# Altium schematic sheet modFOC-Powerstage.SchDoc: modFOC-Powerstage
size A4; Organization: HTL St. Pölten; Address1: Mathias Giller; DocumentNumber: 3; Revision: 1.0; SheetNumber: 3; SheetTotal: 3
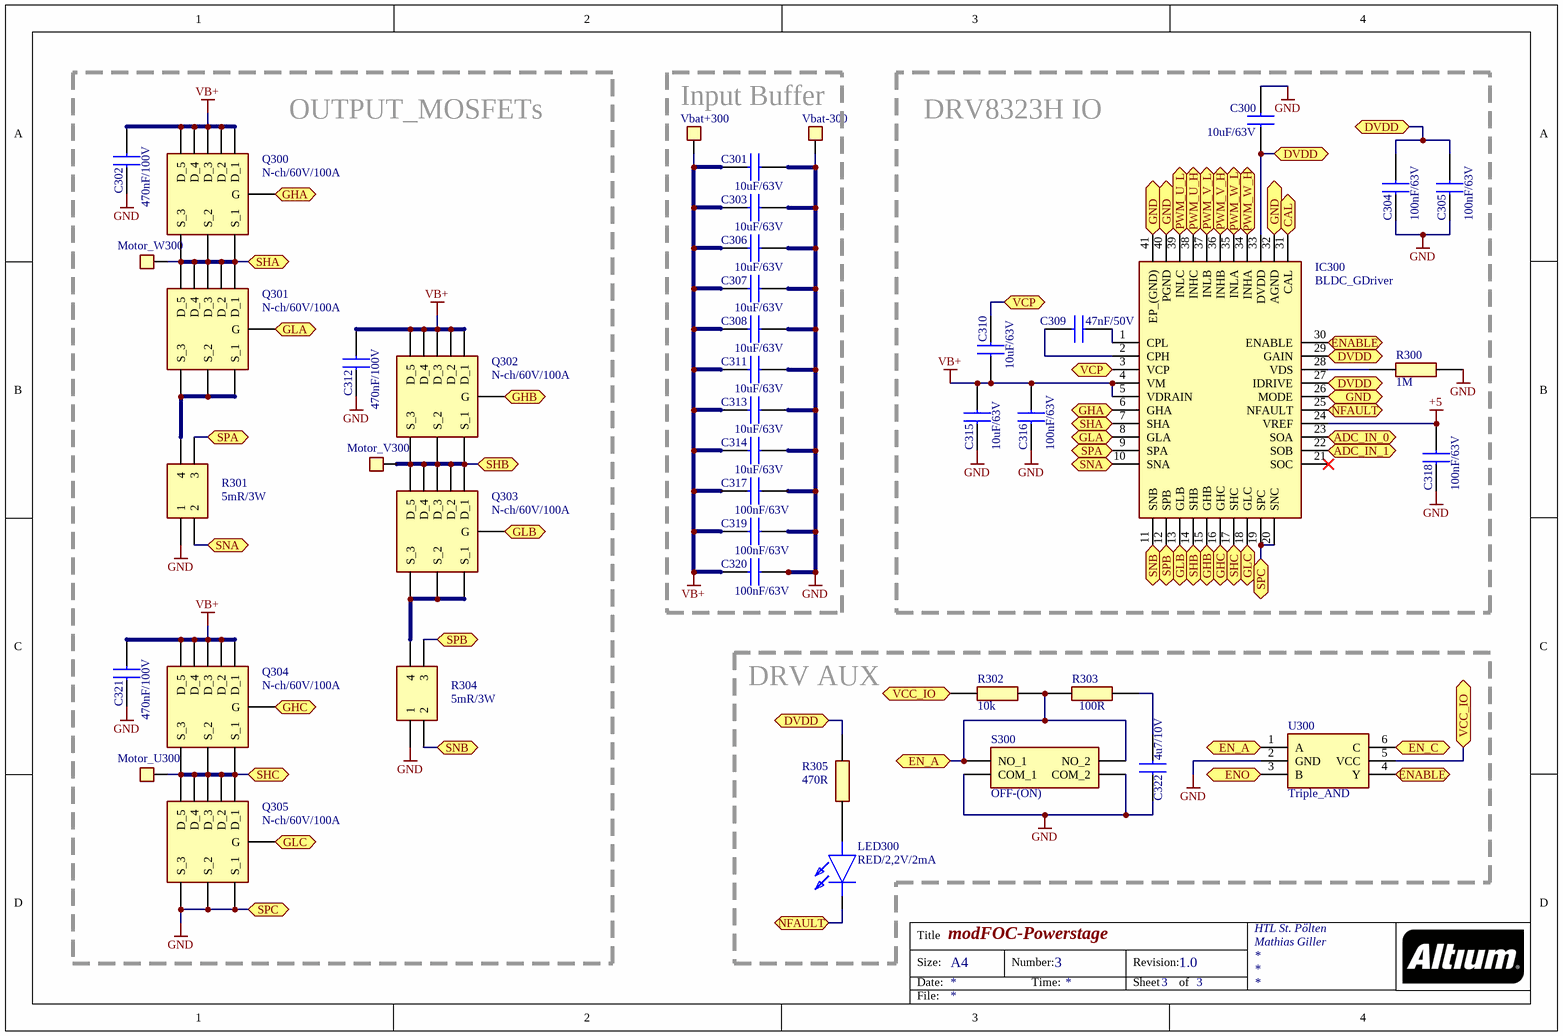
[diagram p0: modFOC-Powerstage.SchDoc]

## Parts
C300  10uF/63V  [CAPC3225X280N]
C301  10uF/63V  [CAPC3225X280N]
C302  470nF/100V  [CAPC2012X140N]
C303  10uF/63V  [CAPC3225X280N]
C304  100nF/63V  [CAPC1608X97N]
C305  100nF/63V  [CAPC1608X97N]
C306  10uF/63V  [CAPC3225X280N]
C307  10uF/63V  [CAPC3225X280N]
C308  10uF/63V  [CAPC3225X280N]
C309  47nF/50V  [CAPC1608X90N]
C310  10uF/63V  [CAPC3225X280N]
C311  10uF/63V  [CAPC3225X280N]
C312  470nF/100V  [CAPC2012X140N]
C313  10uF/63V  [CAPC3225X280N]
C314  10uF/63V  [CAPC3225X280N]
C315  10uF/63V  [CAPC3225X280N]
C316  100nF/63V  [CAPC1608X97N]
C317  100nF/63V  [CAPC1608X97N]
C318  100nF/63V  [CAPC1608X97N]
C319  100nF/63V  [CAPC1608X97N]
C320  100nF/63V  [CAPC1608X97N]
C321  470nF/100V  [CAPC2012X140N]
C322  4u7/10V  [CAPC1608X90N]
IC300  BLDC_GDriver  [QFN50P600X600X80-41N-D]
LED300  RED/2,2V/2mA  [LSL29KG1J21Z]
Motor_U300  PowerPad  [POWER_PAD]  (value not drawn)
Motor_V300  PowerPad  [POWER_PAD]  (value not drawn)
Motor_W300  PowerPad  [POWER_PAD]  (value not drawn)
Q300  N-ch/60V/100A  [TPHR9003NLL1Q]
Q301  N-ch/60V/100A  [TPHR9003NLL1Q]
Q302  N-ch/60V/100A  [TPHR9003NLL1Q]
Q303  N-ch/60V/100A  [TPHR9003NLL1Q]
Q304  N-ch/60V/100A  [TPHR9003NLL1Q]
Q305  N-ch/60V/100A  [TPHR9003NLL1Q]
R300  1M  [RESC1608X55N]
R301  5mR/3W  [WSK12161L000FEA]
R302  10k  [RESC1608X55N]
R303  100R  [RESC1608X55N]
R304  5mR/3W  [WSK12161L000FEA]
R305  470R  [RESC1608X55N]
S300  OFF-(ON)  [PTS647SK38SMTR2LFS]
U300  Triple_AND  [SOT95P285X140-6N]
Vbat+300  PW_PAD_SMOL  [PW_PAD_SMOL]  (value not drawn)
Vbat-300  PW_PAD_SMOL  [PW_PAD_SMOL]  (value not drawn)

## Blocks framed on the sheet
OUTPUT_MOSFETs: C302 C312 C321 Motor_U300 Motor_V300 Motor_W300 Q300-Q305 R301 R304
Input Buffer: C301 C303 C306-C308 C311 C313 C314 C317 C319 C320 Vbat+300 Vbat-300
DRV8323H IO: C300 C304 C305 C309 C310 C315 C316 C318 IC300 R300
DRV AUX: C322 LED300 R302 R303 R305 S300 U300

## Ports
ADC_IN_0 (bidir), ADC_IN_1 (bidir), CAL (bidir), DVDD (bidir), EN_A (bidir), EN_C (bidir), ENABLE (bidir), ENO (bidir), GHA (bidir), GHB (bidir), GHC (bidir), GLA (bidir), GLB (bidir), GLC (bidir), GND (bidir), NFAULT (bidir), PWM_U_H (bidir), PWM_U_L (bidir), PWM_V_H (bidir), PWM_V_L (bidir), PWM_W_H (bidir), PWM_W_L (bidir), SHA (bidir), SHB (bidir), SHC (bidir), SNA (bidir), SNB (bidir), SPA (bidir), SPB (bidir), SPC (bidir), VCC_IO (bidir), VCP (bidir)

## Nets
+5: C318.2 IC300.24(VREF)
GND: C300.1 C301.1 C302.1 C303.1 C304.1 C305.1 C306.1 C307.1 C308.1 C311.1 C312.1 C313.1 C314.1 C315.1 C316.1 C317.2 C318.1 C319.2 C320.2 C321.1 C322.1 IC300.19(SPC) IC300.20(SNC) Q305.1(S_1) Q305.2(S_2) Q305.3(S_3) R300.2 R301.1 R304.1 S300.3(COM_1) S300.4(COM_2) U300.2(GND) Vbat-300.1 ; port SPC
VB+: C301.2 C302.2 C303.2 C306.2 C307.2 C308.2 C310.1 C311.2 C312.2 C313.2 C314.2 C315.2 C316.2 C317.1 C319.1 C320.1 C321.2 IC300.4(VM) IC300.5(VDRAIN) Q300.5(D_1) Q300.6(D_2) Q300.7(D_3) Q300.8(D_4) Q300.9(D_5) Q302.5(D_1) Q302.6(D_2) Q302.7(D_3) Q302.8(D_4) Q302.9(D_5) Q304.5(D_1) Q304.6(D_2) Q304.7(D_3) Q304.8(D_4) Q304.9(D_5) Vbat+300.1
ADC_IN_0: IC300.23(SOA) ; port ADC_IN_0
ADC_IN_1: IC300.22(SOB) ; port ADC_IN_1
CAL: IC300.31(CAL) ; port CAL
DVDD: C300.2 C304.2 C305.2 IC300.27(IDRIVE) IC300.29(GAIN) IC300.33(DVDD) R305.2 ; port DVDD
EN_A: R302.2 R303.1 S300.1(NO_1) S300.2(NO_2) U300.1(A) ; port EN_A
EN_C: U300.6(C) ; port EN_C
ENABLE: IC300.30(ENABLE) U300.4(Y) ; port ENABLE
ENO: U300.3(B) ; port ENO
GHA: IC300.6(GHA) Q300.4(G) ; port GHA
GHB: IC300.15(GHB) Q302.4(G) ; port GHB
GHC: IC300.16(GHC) Q304.4(G) ; port GHC
GLA: IC300.8(GLA) Q301.4(G) ; port GLA
GLB: IC300.13(GLB) Q303.4(G) ; port GLB
GLC: IC300.18(GLC) Q305.4(G) ; port GLC
GND: IC300.26(MODE) IC300.32(AGND) IC300.40(PGND) IC300.41(EP_(GND)) ; port GND  [a separate net that carries the same name]
NFAULT: IC300.25(NFAULT) LED300.1(K) ; port NFAULT
PWM_U_H: IC300.38(INHC) ; port PWM_U_H
PWM_U_L: IC300.39(INLC) ; port PWM_U_L
PWM_V_H: IC300.36(INHB) ; port PWM_V_H
PWM_V_L: IC300.37(INLB) ; port PWM_V_L
PWM_W_H: IC300.34(INHA) ; port PWM_W_H
PWM_W_L: IC300.35(INLA) ; port PWM_W_L
SHA: IC300.7(SHA) Motor_W300.1 Q300.1(S_1) Q300.2(S_2) Q300.3(S_3) Q301.5(D_1) Q301.6(D_2) Q301.7(D_3) Q301.8(D_4) Q301.9(D_5) ; port SHA
SHB: IC300.14(SHB) Motor_V300.1 Q302.1(S_1) Q302.2(S_2) Q302.3(S_3) Q303.5(D_1) Q303.6(D_2) Q303.7(D_3) Q303.8(D_4) Q303.9(D_5) ; port SHB
SHC: IC300.17(SHC) Motor_U300.1 Q304.1(S_1) Q304.2(S_2) Q304.3(S_3) Q305.5(D_1) Q305.6(D_2) Q305.7(D_3) Q305.8(D_4) Q305.9(D_5) ; port SHC
SNA: IC300.10(SNA) R301.2 ; port SNA
SNB: IC300.11(SNB) R304.2 ; port SNB
SPA: IC300.9(SPA) R301.3 ; port SPA
SPB: IC300.12(SPB) R304.3 ; port SPB
VCC_IO: R302.1 U300.5(VCC) ; port VCC_IO
VCP: C310.2 IC300.3(VCP) ; port VCP
NetC309_1: C309.1 IC300.2(CPH)
NetC309_2: C309.2 IC300.1(CPL)
NetC322_2: C322.2 R303.2
NetIC300_28: IC300.28(VDS) R300.1
NetLED300_2: LED300.2(A) R305.1
NetQ301_1: Q301.1(S_1) Q301.2(S_2) Q301.3(S_3) R301.4
NetQ303_1: Q303.1(S_1) Q303.2(S_2) Q303.3(S_3) R304.4

Not connected (* = marked no-connect by the designer): IC300 21(SOC)*

## Notes on the sheet
- Title
- Size:
- Date:
- A4
- Number:
- Time:
- Revision:
- Sheet
- of
- File:

## Library data of the parts
C300 C301 C303 C306-C308 C310 C311 C313-C315 = CL32B106KMVNNWE: Capacitor; Manufacturer_Name: Samsung Electro-Mechanics; Datasheet Link: https://www.arrow.com/en/products/cl32b106kmvnnwe/samsung-electro-mechanics; Height: 2.8mm; Manufacturer_Part_Number: CL32B106KMVNNWE; Arrow Part Number: CL32B106KMVNNWE; Arrow Price/Stock: https://www.arrow.com/en/products/cl32b106kmvnnwe/samsung-electro-mechanics; Mouser Part Number: 187-CL32B106KMVNNWE; Mouser Price/Stock: https://www.mouser.co.uk/ProductDetail/Samsung-Electro-Mechanics/CL32B106KMVNNWE?qs=xZ%2FP%252Ba9zWqaEMBbSgKy8gQ%3D%3D
C302 C312 C321 = 08051C474KAT2A: Capacitor; Manufacturer_Name: AVX; Datasheet Link: http://datasheets.avx.com/X7RDielectric.pdf; Height: 1.4mm; Manufacturer_Part_Number: 08051C474KAT2A; Mouser Part Number: 581-08051C474KAT2A; Mouser Price/Stock: https://www.mouser.co.uk/ProductDetail/AVX/08051C474KAT2A?qs=%2FjdEcI0p95Mz%2FN5KbrGN6Q%3D%3D
C304 C305 C316-C320 = C0805C104MMREC7210: Capacitor; Manufacturer_Name: Vishay; Manufacturer_Part_Number: VJ0603Y104JXJAC; Datasheet Link: http://www.vishay.com/docs/45226/vj31xrohsautomlcc.pdf; Height: 1mm; Mouser Part Number: 77-VJ0603Y104JXJAC; Mouser Price/Stock: https://www.mouser.com/Search/Refine.aspx?Keyword=77-VJ0603Y104JXJAC
C309 = CGA3E2X7R1H473K080AA: Capacitor; Manufacturer_Name: TDK; Datasheet Link: http://docs-emea.rs-online.com/webdocs/14e9/0900766b814e9125.pdf; Height: 0.9mm; Manufacturer_Part_Number: CGA3E2X7R1H473K080AA; Mouser Part Number: 810-CGA3E2X7R1H473K; Mouser Price/Stock: https://www.mouser.co.uk/ProductDetail/TDK/CGA3E2X7R1H473K080AA?qs=NRhsANhppD%252BXNlr9LoLgTw%3D%3D; Arrow Part Number: CGA3E2X7R1H473K080AA; Arrow Price/Stock: https://www.arrow.com/en/products/cga3e2x7r1h473k080aa/tdk
C322 = CL10A475KP8NNNC: Capacitor; Manufacturer_Name: Samsung Electro-Mechanics; Datasheet Link: https://www.arrow.com/en/products/cl10a475kp8nnnc/samsung-electro-mechanics; Height: 0.9mm; Manufacturer_Part_Number: CL10A475KP8NNNC; Mouser Part Number: 187-CL10A475KP8NNNC; Mouser Price/Stock: https://www.mouser.co.uk/ProductDetail/Samsung-Electro-Mechanics/CL10A475KP8NNNC/?qs=hqM3L16%252BxlfQRmkWsZz5vA%3D%3D; Arrow Part Number: CL10A475KP8NNNC; Arrow Price/Stock: https://www.arrow.com/en/products/cl10a475kp8nnnc/samsung-electro-mechanics
IC300 = DRV8323HRTAR: Integrated Circuit; Manufacturer_Name: Texas Instruments; Datasheet Link: http://www.ti.com/lit/gpn/drv8323; Height: 0.8mm; Manufacturer_Part_Number: DRV8323HRTAR; Mouser Part Number: 595-DRV8323HRTAR; Mouser Price/Stock: https://www.mouser.co.uk/ProductDetail/Texas-Instruments/DRV8323HRTAR?qs=u4fy%2FsgLU9N%252BsI8bz2iwaQ%3D%3D; Arrow Part Number: DRV8323HRTAR; Arrow Price/Stock: https://www.arrow.com/en/products/drv8323hrtar/texas-instruments
LED300 = LS_L29K-G1J2-1-Z: LED; Manufacturer_Name: OSRAM; Manufacturer_Part_Number: LS L29K-G1J2-1-Z; Datasheet Link: https://dammedia.osram.info/media/resource/hires/osram-dam-5662679/LS%20L29K_EN.pdf; Height: 0.67mm; Mouser Part Number: 720-LSL29K-G1J2-1-Z; Mouser Price/Stock: https://www.mouser.co.uk/ProductDetail/OSRAM-Opto-Semiconductors/LS-L29K-G1J2-1-Z?qs=nTDll3UaDK6mUW9LNPY0Mw%3D%3D
Q300-Q305 = TPH2R506PL,L1Q: MOSFET (N-Channel); Manufacturer_Name: Toshiba; Datasheet Link: http://toshiba.semicon-storage.com/info/docget.jsp?did=55522&prodName=TPH2R506PL; Height: 1mm; Manufacturer_Part_Number: TPH2R506PL,L1Q; Mouser Part Number: 757-TPH2R506PLL1Q; Mouser Price/Stock: https://www.mouser.co.uk/ProductDetail/Toshiba/TPH2R506PLL1Q?qs=bUPhaerQQeFGJjj6SxbPEQ%3D%3D; Arrow Part Number: TPH2R506PL,L1Q; Arrow Price/Stock: https://www.arrow.com/en/products/tph2r506pll1q/toshiba
R300 = RC0603FR-071ML: Resistor; Manufacturer_Name: YAGEO (PHYCOMP); Datasheet Link: https://www.yageo.com/upload/media/product/productsearch/datasheet/rchip/PYu-RC_Group_51_RoHS_L_11.pdf; Height: 0.55mm; Manufacturer_Part_Number: RC0603FR-071ML; Mouser Part Number: 603-RC0603FR-071ML; Mouser Price/Stock: https://www.mouser.co.uk/ProductDetail/Yageo/RC0603FR-071ML/?qs=VU8sRB4EgwDPceeQKB324w%3D%3D; Arrow Part Number: RC0603FR-071ML; Arrow Price/Stock: https://www.arrow.com/en/products/rc0603fr-071ml/yageo
R301 R304 = WSK1216L5000FEA: Resistor; Manufacturer_Name: Vishay; Datasheet Link: http://www.vishay.com/docs/30189/wsk1216.pdf; Height: 1.9mm; Manufacturer_Part_Number: WSK1216L5000FEA
R302 = RC0603FR-0710KL: Resistor; Manufacturer_Name: YAGEO (PHYCOMP); Datasheet Link: http://www.yageo.com/documents/recent/PYu-RC0603_51_RoHS_L_v5.pdf; Height: 0.55mm; Manufacturer_Part_Number: RC0603FR-0710KL; Arrow Part Number: RC0603FR-0710KL; Arrow Price/Stock: https://www.arrow.com/en/products/rc0603fr-0710kl/yageo; Mouser Part Number: 603-RC0603FR-0710KL; Mouser Price/Stock: https://www.mouser.co.uk/ProductDetail/Yageo/RC0603FR-0710KL?qs=grNVn54RoB%252B3GtjbJj3wJQ%3D%3D
R303 = CRCW0603100RFKEAC: Resistor; Manufacturer_Name: Vishay; Datasheet Link: https://componentsearchengine.com/Datasheets/1/CRCW0603100RFKEAC.pdf; Height: 0.55mm; Manufacturer_Part_Number: CRCW0603100RFKEAC; Mouser Part Number: 71-CRCW0603100RFKEAC; Mouser Price/Stock: https://www.mouser.co.uk/ProductDetail/Vishay-Dale/CRCW0603100RFKEAC/?qs=E3Y5ESvWgWPJqb4%2F19sAKw%3D%3D; Arrow Part Number: CRCW0603100RFKEAC; Arrow Price/Stock: https://www.arrow.com/en/products/crcw0603100rfkeac/vishay
R305 = RC0603FR-10470RL: Resistor; Manufacturer_Name: YAGEO (PHYCOMP); Datasheet Link: http://www.yageo.com/documents/recent/PYu-RC0603_51_RoHS_L_v5.pdf; Height: 0.55mm; Manufacturer_Part_Number: RC0603FR-10470RL; Mouser Part Number: 603-RC0603FR-10470RL; Mouser Price/Stock: https://www.mouser.co.uk/ProductDetail/Yageo/RC0603FR-10470RL?qs=EiqXWrxQq62gi8HBTlzDog%3D%3D
S300 = PTS647SK38SMTR2LFS: Switch; Manufacturer_Name: C & K COMPONENTS; Datasheet Link: https://www.ckswitches.com/media/2567/pts647.pdf; Height: 3.8mm; Manufacturer_Part_Number: PTS647SK38SMTR2LFS; Mouser Part Number: 611-PTS647SK38SMTR2L; Mouser Price/Stock: https://www.mouser.co.uk/ProductDetail/CK/PTS647SK38SMTR2LFS/?qs=PqoDHHvF649Jgx1Ch2uMjg%3D%3D
U300 = 74LVC1G11W6-7: 3 Input AND Gate; Manufacturer_Name: Diodes Inc.; Datasheet Link: https://www.diodes.com/assets/Datasheets/74LVC1G11.pdf; Height: 1.4mm; Manufacturer_Part_Number: 74LVC1G11W6-7; Mouser Part Number: 621-74LVC1G11W6-7; Mouser Price/Stock: https://www.mouser.com/Search/Refine.aspx?Keyword=621-74LVC1G11W6-7; Arrow Part Number: 74LVC1G11W6-7; Arrow Price/Stock: https://www.arrow.com/en/products/74lvc1g11w6-7/diodes-incorporated